# EAGLE design Intan_32 (EAGLE 7.2.0)
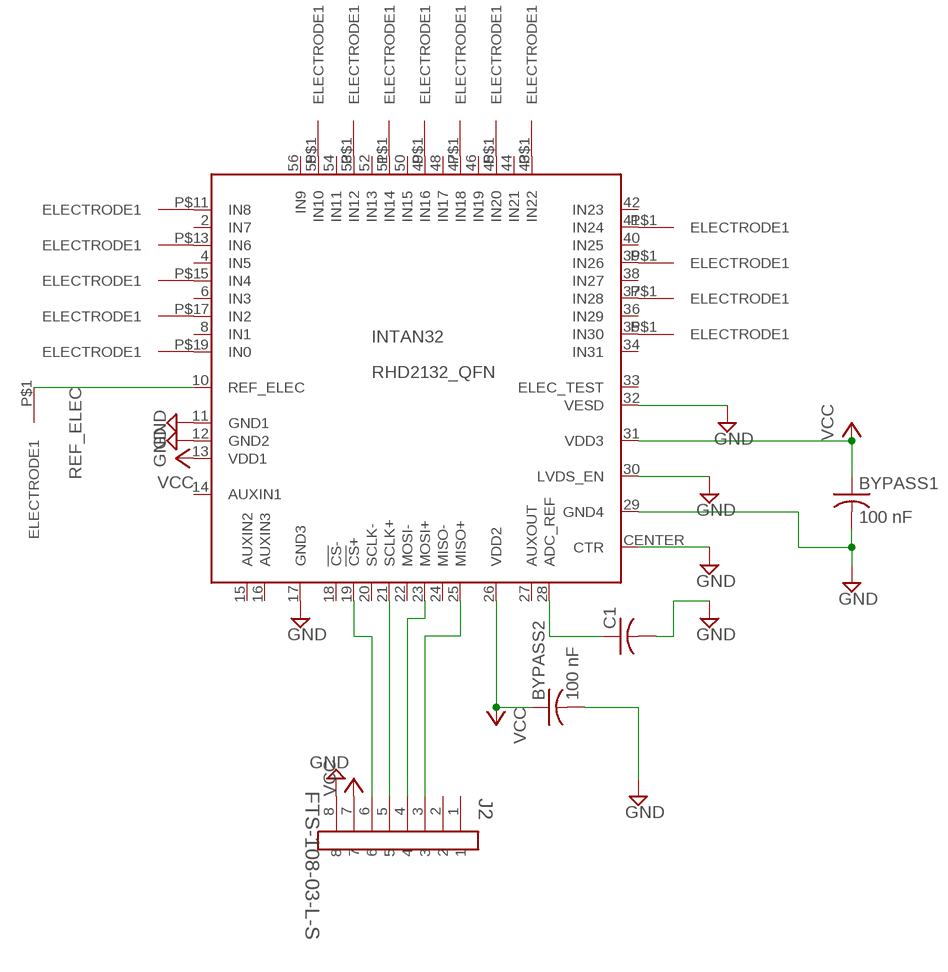
[diagram p0: schematic, sheet 1]

## Parts
BYPASS1  100 nF  C-USC0402  [C0402]
BYPASS2  100 nF  C-USC0402  [C0402]
C1  C-USC0402  [C0402]
INTAN32  RHD2132_QFN  [QFN56_8_X_8_LARGE]
J2  FTS-108-03-L-S  [SAMTEC_FTS-108-03-S]
REF_ELEC  INTAN_ELECTRODE_HOLE_2323MIL  [INTAN_ELECTRODE_HOLE_23]
U$1  INTAN_ELECTRODE_HOLE_2323MIL  [INTAN_ELECTRODE_HOLE_23]
U$2  INTAN_ELECTRODE_HOLE_2323MIL  [INTAN_ELECTRODE_HOLE_23]
U$3  INTAN_ELECTRODE_HOLE_2323MIL  [INTAN_ELECTRODE_HOLE_23]
U$4  INTAN_ELECTRODE_HOLE_2323MIL  [INTAN_ELECTRODE_HOLE_23]
U$5  INTAN_ELECTRODE_HOLE_2323MIL  [INTAN_ELECTRODE_HOLE_23]
U$6  INTAN_ELECTRODE_HOLE_2323MIL  [INTAN_ELECTRODE_HOLE_23]
U$7  INTAN_ELECTRODE_HOLE_2323MIL  [INTAN_ELECTRODE_HOLE_23]
U$8  INTAN_ELECTRODE_HOLE_2323MIL  [INTAN_ELECTRODE_HOLE_23]
U$9  INTAN_ELECTRODE_HOLE_2323MIL  [INTAN_ELECTRODE_HOLE_23]
U$10  INTAN_ELECTRODE_HOLE_2323MIL  [INTAN_ELECTRODE_HOLE_23]
U$11  INTAN_ELECTRODE_HOLE_2323MIL  [INTAN_ELECTRODE_HOLE_23]
U$12  INTAN_ELECTRODE_HOLE_2323MIL  [INTAN_ELECTRODE_HOLE_23]
U$13  INTAN_ELECTRODE_HOLE_2323MIL  [INTAN_ELECTRODE_HOLE_23]
U$14  INTAN_ELECTRODE_HOLE_2323MIL  [INTAN_ELECTRODE_HOLE_23]
U$15  INTAN_ELECTRODE_HOLE_2323MIL  [INTAN_ELECTRODE_HOLE_23]
U$16  INTAN_ELECTRODE_HOLE_2323MIL  [INTAN_ELECTRODE_HOLE_23]

## Nets
GND: BYPASS1.2 BYPASS2.2 C1.2 INTAN32.11(GND1) INTAN32.12(GND2) INTAN32.17(GND3) INTAN32.29(GND4) INTAN32.30(LVDS_EN) INTAN32.32(VESD) INTAN32.CENTER(CTR) J2.8
N$1: INTAN32.25(MISO+) J2.3
N$2: C1.1 INTAN32.28(ADC_REF)
N$3: INTAN32.9(IN0) U$1.P$1(ELECTRODE1)
N$4: INTAN32.7(IN2) U$2.P$1(ELECTRODE1)
N$5: INTAN32.23(MOSI+) J2.4
N$6: INTAN32.5(IN4) U$3.P$1(ELECTRODE1)
N$7: INTAN32.3(IN6) U$4.P$1(ELECTRODE1)
N$8: INTAN32.1(IN8) U$5.P$1(ELECTRODE1)
N$9: INTAN32.55(IN10) U$6.P$1(ELECTRODE1)
N$10: INTAN32.19(!CS!+) J2.6
N$11: INTAN32.21(SCLK+) J2.5
N$13: INTAN32.53(IN12) U$7.P$1(ELECTRODE1)
N$14: INTAN32.51(IN14) U$8.P$1(ELECTRODE1)
N$15: INTAN32.49(IN16) U$9.P$1(ELECTRODE1)
N$16: INTAN32.47(IN18) U$10.P$1(ELECTRODE1)
N$17: INTAN32.45(IN20) U$11.P$1(ELECTRODE1)
N$18: INTAN32.43(IN22) U$12.P$1(ELECTRODE1)
N$19: INTAN32.41(IN24) U$13.P$1(ELECTRODE1)
N$20: INTAN32.39(IN26) U$14.P$1(ELECTRODE1)
N$21: INTAN32.37(IN28) U$15.P$1(ELECTRODE1)
N$22: INTAN32.35(IN30) U$16.P$1(ELECTRODE1)
REF_ELEC: INTAN32.10(REF_ELEC) REF_ELEC.P$1(ELECTRODE1)
VCC: BYPASS1.1 BYPASS2.1 INTAN32.13(VDD1) INTAN32.26(VDD2) INTAN32.31(VDD3) J2.7
Unconnected: INTAN32.2(IN7) INTAN32.4(IN5) INTAN32.6(IN3) INTAN32.8(IN1) INTAN32.14(AUXIN1) INTAN32.15(AUXIN2) INTAN32.16(AUXIN3) INTAN32.18(!CS!-) INTAN32.20(SCLK-) INTAN32.22(MOSI-) INTAN32.24(MISO-) INTAN32.27(AUXOUT) INTAN32.33(ELEC_TEST) INTAN32.34(IN31) INTAN32.36(IN29) INTAN32.38(IN27) INTAN32.40(IN25) INTAN32.42(IN23) INTAN32.44(IN21) INTAN32.46(IN19) INTAN32.48(IN17) INTAN32.50(IN15) INTAN32.52(IN13) INTAN32.54(IN11) INTAN32.56(IN9) J2.1 J2.2

## Library data of the parts
BYPASS1 BYPASS2 C1 = rcl:C-US: CAPACITOR, American symbol
INTAN32 = RHD2000:RHD2132: Intan Technologies RHD2132 chip
J2 = samtec_fts:FTS-108-03-L-S: CONN HEADER, 1.27MM, VERTICAL THT, 16WAY; MPN: FTS-108-03-L-D; OC_FARNELL: 1929684; OC_NEWARK: 11P4665; PACKAGE: HEADER, 1.27MM, VERTICAL THT, 16WAY; SUPPLIER: Samtec
REF_ELEC U$1-U$16 = Intan_electrode_hole:INTAN_ELECTRODE_HOLE_23

## Board
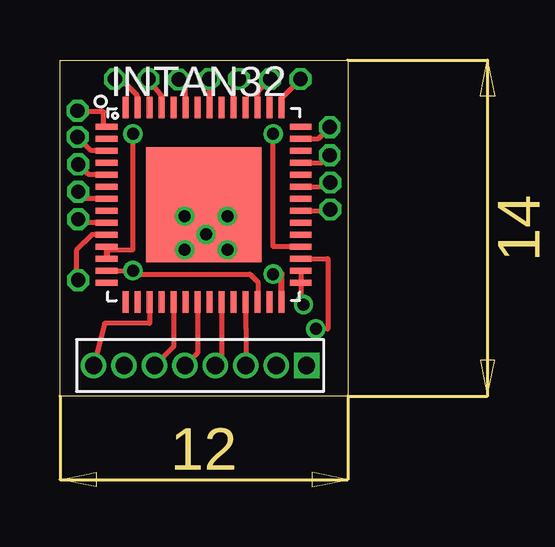
[diagram p1: board, top side]
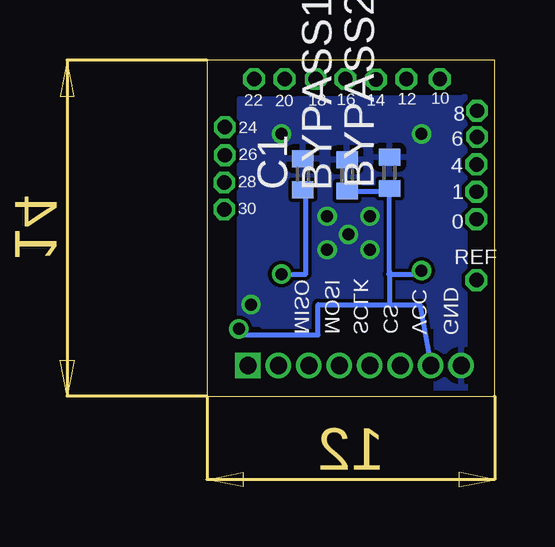
[diagram p2: board, bottom side, seen from below]

Size 12 x 14 mm. Coordinates in mm from the lower left corner, seen from the top.
Outline: 0,0 0,14 12,14 12,0 0,0
Copper layers (1*16): Top 0.035mm / dielectric 1.5mm / Bottom 0.035mm
Design rules "default *": minimum track width 6mil, minimum drill 12mil, track to track 6mil, track to pad 6mil, pad to pad 6mil, via to via 6mil, smd to smd 0mil, copper to edge 10mil, drill to drill 10mil, minimum pad ring 6mil, minimum via ring 6mil, stop-mask expansion 2mil, vias tented up to drill 25mil, thermal gap 10mil

### Footprints (pad centres in the part's own frame; a part is rotated, then mirrored left to right if it is on the bottom)
C0402 = smd 0.7 x 0.9: 1 -0.65,0; 2 0.65,0
QFN56_8_X_8_LARGE = smd 0.9 x 0.25: 1 -4.05,3.25; 2 -4.05,2.75; 3 -4.05,2.25; 4 -4.05,1.75; 5 -4.05,1.25; 6 -4.05,0.75; 7 -4.05,0.25; 8 -4.05,-0.25; 9 -4.05,-0.75; 10 -4.05,-1.25; 11 -4.05,-1.75; 12 -4.05,-2.25; 13 -4.05,-2.75; 14 -4.05,-3.25; 29 4.05,-3.25; 30 4.05,-2.75; 31 4.05,-2.25; 32 4.05,-1.75; 33 4.05,-1.25; 34 4.05,-0.75; 35 4.05,-0.25; 36 4.05,0.25; 37 4.05,0.75; 38 4.05,1.25; 39 4.05,1.75; 40 4.05,2.25; 41 4.05,2.75; 42 4.05,3.25 | smd 0.25 x 0.9: 15 -3.25,-4.05; 16 -2.75,-4.05; 17 -2.25,-4.05; 18 -1.75,-4.05; 19 -1.25,-4.05; 20 -0.75,-4.05; 21 -0.25,-4.05; 22 0.25,-4.05; 23 0.75,-4.05; 24 1.25,-4.05; 25 1.75,-4.05; 26 2.25,-4.05; 27 2.75,-4.05; 28 3.25,-4.05; 43 3.25,4.05; 44 2.75,4.05; 45 2.25,4.05; 46 1.75,4.05; 47 1.25,4.05; 48 0.75,4.05; 49 0.25,4.05; 50 -0.25,4.05; 51 -0.75,4.05; 52 -1.25,4.05; 53 -1.75,4.05; 54 -2.25,4.05; 55 -2.75,4.05; 56 -3.25,4.05 | smd 4.8 x 4.8: CENTER 0,0
SAMTEC_FTS-108-03-S = drill 0.711 square: 1 0,0 | drill 0.711: 2 1.27,0; 3 2.54,0; 4 3.81,0; 5 5.08,0; 6 6.35,0; 7 7.62,0; 8 8.89,0
INTAN_ELECTRODE_HOLE_23 = drill 0.6 octagon: P$1 0,0

### Placement (x,y rotation side)
BYPASS1  6.15,9.19 90 bottom
BYPASS2  4.39,9.3 90 bottom
C1  8,9.24 90 bottom
INTAN32  6,7.97 0 top
J2  10.29,1.27 180 top
REF_ELEC  0.76,4.83 0 top
U$1  0.76,7.37 0 top
U$2  0.76,8.51 0 top
U$3  0.76,9.65 0 top
U$4  0.74,10.79 270 top
U$5  0.74,11.89 0 top
U$6  2.29,13.21 0 top
U$7  3.68,13.21 90 top
U$8  4.95,13.18 0 top
U$9  6.22,13.21 0 top
U$10  7.47,13.21 0 top
U$11  8.76,13.21 0 top
U$12  10.03,13.21 0 top
U$13  11.25,11.2 0 top
U$14  11.25,10.03 0 top
U$15  11.28,8.89 0 top
U$16  11.28,7.77 0 top

### Tracks (layer width: path | path; a pad name or v marks a point on that pad's centre or on a via)
GND  (via drill 0.5, 0.5 pad 0.61)
  Top 0.203: v10.16,3.81 10.05,3.81 INTAN32.29 INTAN32.30 | INTAN32.12 1.95,6.1 3.05,6.1 v3.05,10.92 | INTAN32.32 8.89,6.22 v8.89,10.92 | INTAN32.17 3.73,3.92 3.73,3.02 1.86,3.02 J2.8
  Top 0.254: INTAN32.11 INTAN32.12
  Top 0.406: v5.21,7.49 6,7.49 INTAN32.CENTER
  other vias: 6.99,7.49 6.1,6.73 5.21,6.1 6.99,6.1
  pour Bottom: 1.3,12.47 1.24,12.47 1.24,0.71 1.22,0.71 1.22,0.18 2.46,0.18 2.46,0.28 2.44,0.28 2.44,2.9 9.68,2.9 9.68,2.97 10.64,2.97 10.64,12.4
N$1
  Top 0.203: INTAN32.25 7.75,2.82 J2.3
N$2  (via drill 0.5)
  Top 0.254: INTAN32.28 9.25,5.08 v8.89,5.08
  Bottom 0.203: v8.89,5.08 7.87,5.08 7.87,8.59
  Bottom 0.254: 7.87,8.59 C1.1
N$3
  Top 0.203: INTAN32.9 1.01,7.22 arc-45 0.83,7.3 U$1.P$1
N$4
  Top 0.203: INTAN32.7 1.15,8.22 arc-45 0.97,8.3 U$2.P$1
N$5
  Top 0.203: INTAN32.23 6.73,3.92 6.73,1.52 J2.4
N$6
  Top 0.203: INTAN32.5 1.29,9.22 arc-45 1.12,9.3 U$3.P$1
N$7
  Top 0.203: INTAN32.3 1.31,10.22 U$4.P$1
N$8
  Top 0.203: INTAN32.1 1.83,11.22 1.83,11.84 0.74,11.84 U$5.P$1
N$9
  Top 0.203: INTAN32.55 3.25,12.4 arc45 3.17,12.58 2.61,13.13 arc45 2.44,13.21 U$6.P$1
N$10
  Top 0.203: INTAN32.19 4.75,2.08 J2.6
N$11
  Top 0.203: INTAN32.21 5.75,1.81 J2.5
N$13
  Top 0.203: INTAN32.53 4.25,12.41 arc45 4.17,12.59 U$7.P$1
N$14
  Top 0.203: INTAN32.51 5.25,12.89 U$8.P$1
N$15
  Top 0.203: INTAN32.49 6.25,13.15 arc45 U$9.P$1
N$16
  Top 0.203: INTAN32.47 7.25,12.99 U$10.P$1
N$17
  Top 0.203: INTAN32.45 8.25,12.59 arc-45 8.32,12.77 U$11.P$1
N$18
  Top 0.203: INTAN32.43 9.25,12.32 arc-45 9.32,12.49 U$12.P$1
N$19
  Top 0.203: INTAN32.41 10.78,10.72 U$13.P$1
N$20
  Top 0.203: INTAN32.39 10.94,9.72 U$14.P$1
N$21
  Top 0.203: INTAN32.37 11.11,8.72 U$15.P$1
N$22
  Top 0.203: INTAN32.35 11.23,7.72 U$16.P$1
REF_ELEC
  Top 0.203: INTAN32.10 1.34,6.72 0.69,6.07 0.69,4.9 REF_ELEC.P$1
VCC  (via drill 0.5)
  Top 0.203: INTAN32.31 11.18,5.72 11.18,2.79 v10.67,2.79 | INTAN32.13 v3.05,5.22 | 3.05,5.08 7.92,5.08 8.26,4.75 8.26,3.93 INTAN32.26
  Top 0.254: v3.05,5.22 3.05,5.08
  Bottom 0.203: BYPASS1.1 4.39,8.54 | 4.4,3.81 4.4,5.08 4.4,5.22 | BYPASS2.1 4.39,5.08 3.05,5.08 v3.05,5.22 | 4.4,3.81 7.37,3.81 7.37,2.54 10.67,2.54 | 4.4,3.81 3.13,3.81 J2.7
  Bottom 0.254: 4.39,8.54 BYPASS2.1 | 4.4,5.08 4.39,5.08 | 10.67,2.54 v10.67,2.79

### Text on the board
bPlace: 10 | 12 | 14 | 16 | 18 | 20 | 22 | 8 | 24 | 6 | 26 | 4 | 28 | 1 | 30 | 0 | REF | GND | VCC | CS | SCLK | MOSI | MISO